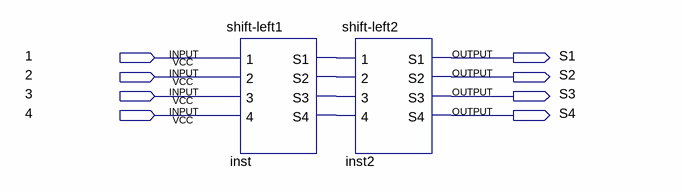
[diagram p0: schematic sheet]
// Quartus schematic shift-left3.bdf as structural Verilog: 2 symbols, 8 pins
module \shift-left3  (
  input  \1 ,
  input  \2 ,
  input  \3 ,
  input  \4 ,
  output S1,
  output S2,
  output S3,
  output S4
);

  wire inst_s1, inst_s2, inst_s3, inst_s4;

  \shift-left1  inst (
    .\1 (\1 ), .\2 (\2 ), .\3 (\3 ), .\4 (\4 ), .S1(inst_s1), .S2(inst_s2), .S3(inst_s3), .S4(inst_s4));
  \shift-left2  inst2 (.\1 (inst_s1), .\2 (inst_s2), .\3 (inst_s3), .\4 (inst_s4), .S1(S1), .S2(S2), .S3(S3), .S4(S4));
endmodule
